# Altium schematic sheet Controller-Old.SchDoc
size A3
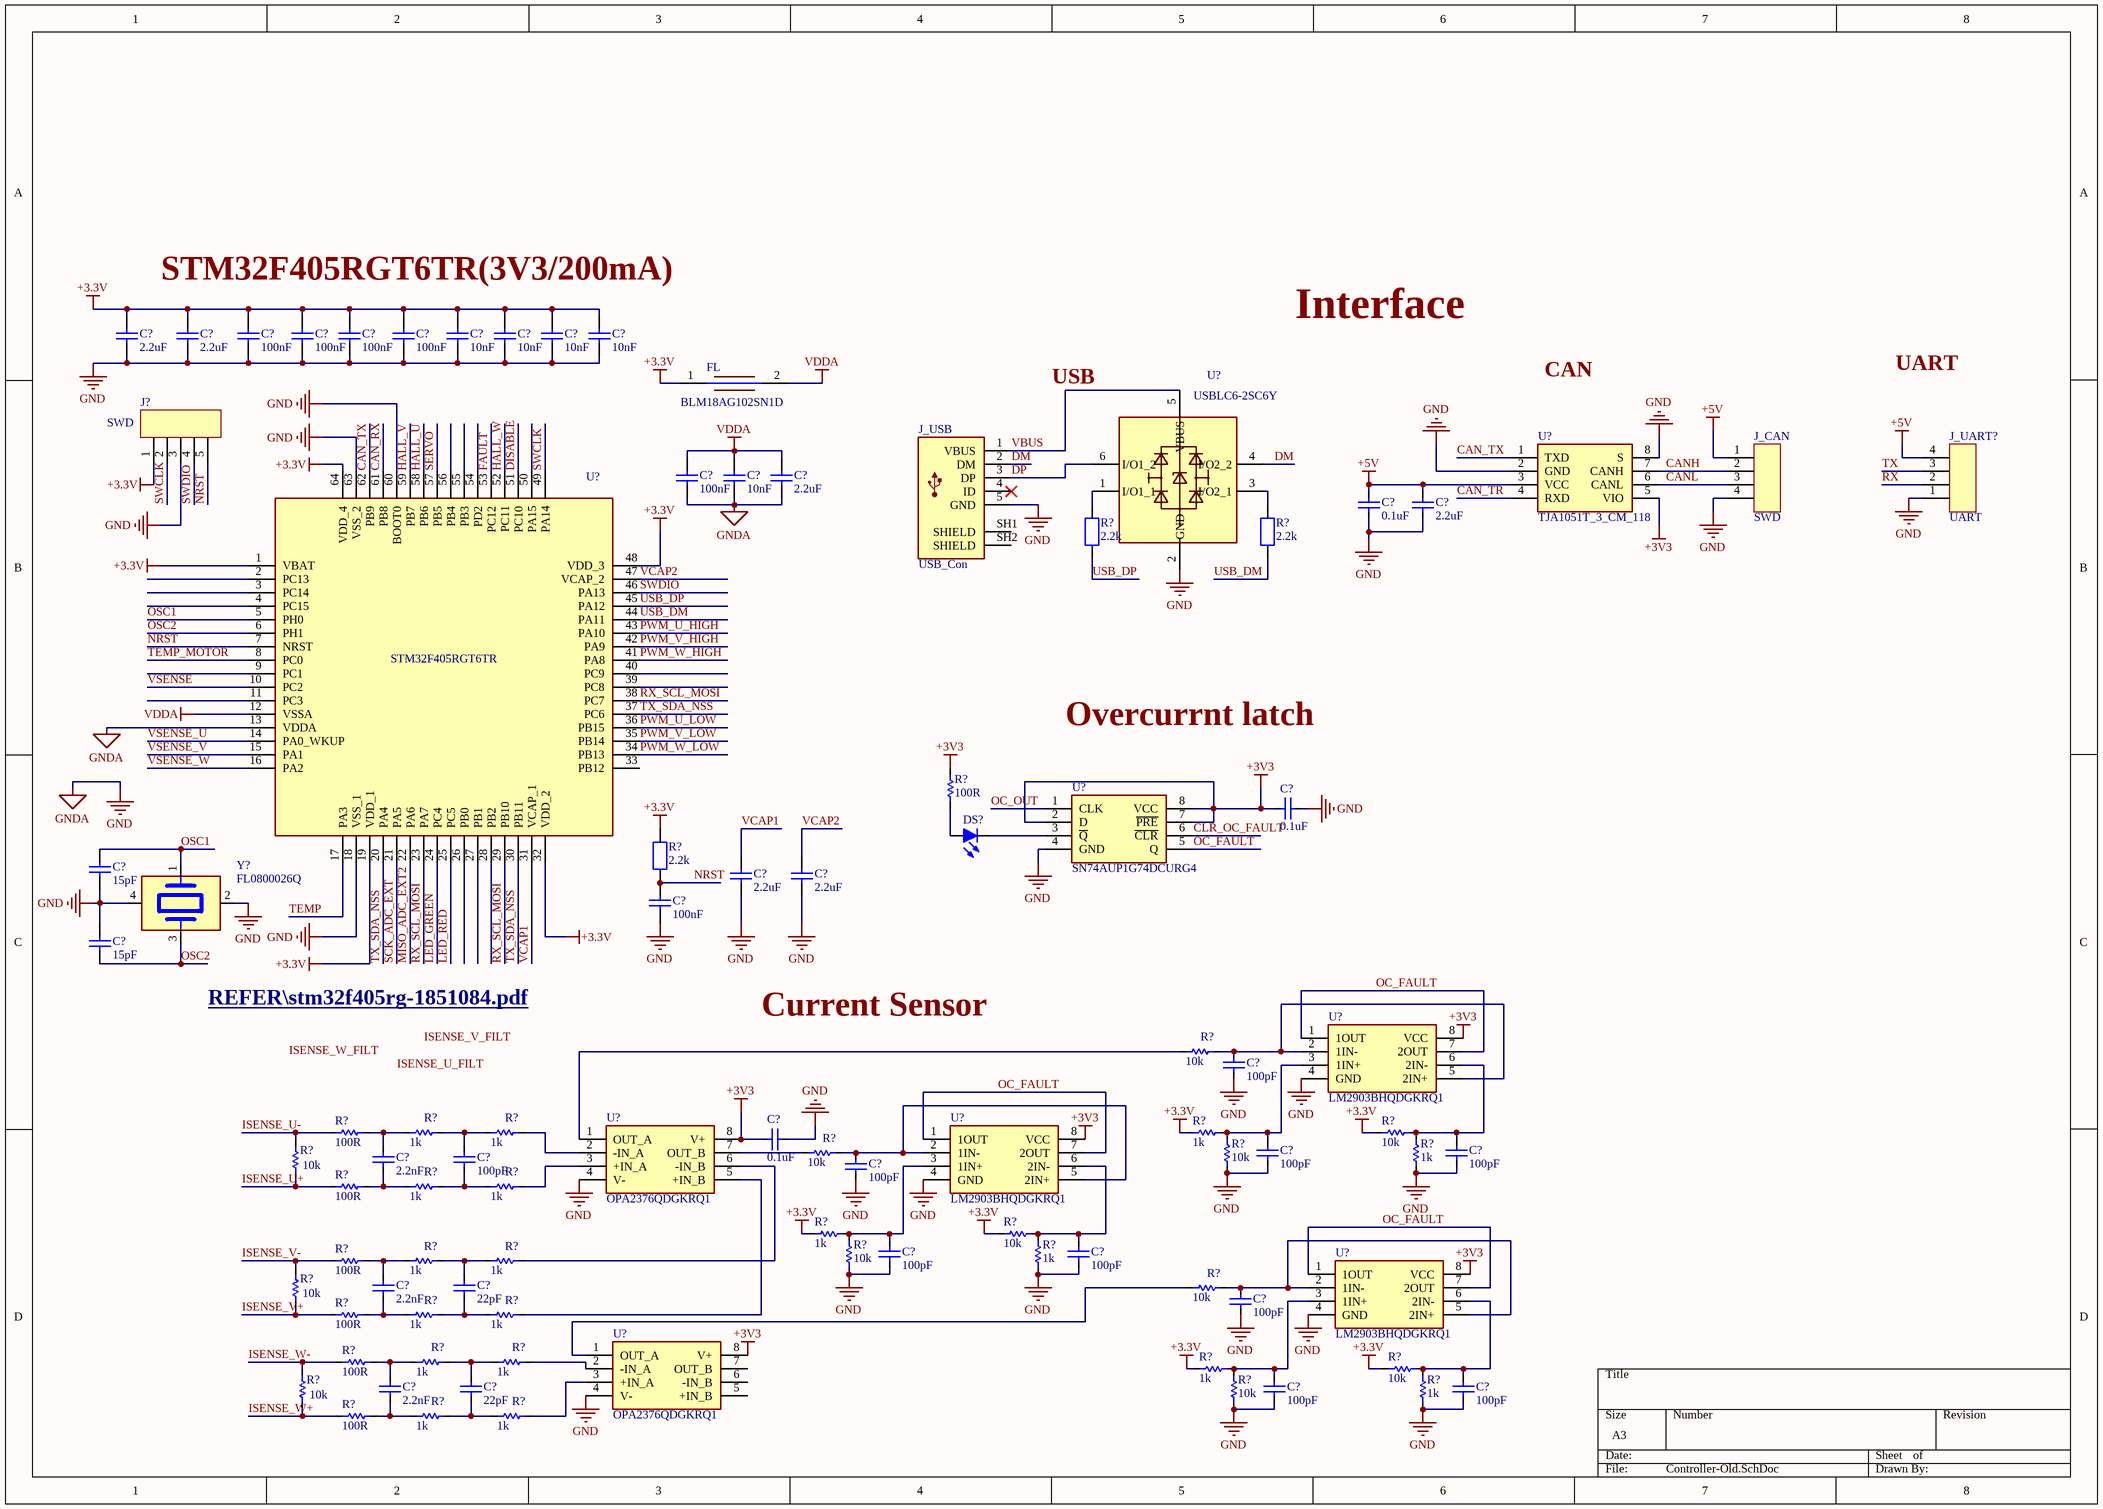
[diagram p0: Controller-Old.SchDoc]

## Parts
(Parts that share a designator on the sheet are numbered #1, #2 ... from top to bottom, then left to right.)
C?#1  2.2uF  [C0603]
C?#2  2.2uF  [C0603]
C?#3  100nF  [C0402]
C?#4  100nF  [C0402]
C?#5  100nF  [C0402]
C?#6  100nF  [C0402]
C?#7  10nF  [C0402]
C?#8  10nF  [C0402]
C?#9  10nF  [C0402]
C?#10  10nF  [C0402]
C?#11  100nF  [C0402]
C?#12  10nF  [C0402]
C?#13  2.2uF  [C0603]
C?#14  0.1uF  [SMD_C(0402)]
C?#15  2.2uF  [SMD_C(0603)]
C?#16  0.1uF  [SMD_C(0402)]
C?#17  15pF  [C0402]
C?#18  2.2uF  [C0603]
C?#19  2.2uF  [C0603]
C?#20  100nF  [C0402]
C?#21  15pF  [C0402]
C?#22  100pF  [SMD_C(0402)]
C?#23  0.1uF  [SMD_C(0402)]
C?#24  100pF  [SMD_C(0402)]
C?#25  100pF  [SMD_C(0402)]
C?#26  2.2nF  [SMD_C(0402)]
C?#27  100pF  [SMD_C(0402)]
C?#28  100pF  [SMD_C(0402)]
C?#29  100pF  [SMD_C(0402)]
C?#30  100pF  [SMD_C(0402)]
C?#31  2.2nF  [SMD_C(0402)]
C?#32  22pF  [SMD_C(0402)]
C?#33  100pF  [SMD_C(0402)]
C?#34  2.2nF  [SMD_C(0402)]
C?#35  22pF  [SMD_C(0402)]
C?#36  100pF  [SMD_C(0402)]
C?#37  100pF  [SMD_C(0402)]
DS?  SML-D12U1WT86  [LED0603]  (value not drawn)
FL  BLM18AG102SN1D  [BLM18EG121SH1D]
J?  SWD  [Header-2.54m-5pin]
J_CAN  SWD  [Header-2.54m-4pin]
J_UART?  UART  [Header-2.54m-4pin]
J_USB  USB_Con  [10118194-0001LF]
R?#1  2.2k  [R0603]
R?#2  2.2k  [R0603]
R?#3  100R  [SMD_R(0402)]
R?#4  2.2k  [R0603]
R?#5  10k  [SMD_R(0402)]
R?#6  1k  [SMD_R(0402)]
R?#7  10k  [SMD_R(0402)]
R?#8  10k  [SMD_R(0402)]
R?#9  1k  [SMD_R(0402)]
R?#10  10k  [SMD_R(0402)]
R?#11  100R  [SMD_R(0402)]
R?#12  1k  [SMD_R(0402)]
R?#13  1k  [SMD_R(0402)]
R?#14  10k  [SMD_R(0402)]
R?#15  100R  [SMD_R(0402)]
R?#16  1k  [SMD_R(0402)]
R?#17  1k  [SMD_R(0402)]
R?#18  1k  [SMD_R(0402)]
R?#19  10k  [SMD_R(0402)]
R?#20  10k  [SMD_R(0402)]
R?#21  1k  [SMD_R(0402)]
R?#22  10k  [SMD_R(0402)]
R?#23  100R  [SMD_R(0402)]
R?#24  1k  [SMD_R(0402)]
R?#25  1k  [SMD_R(0402)]
R?#26  10k  [SMD_R(0402)]
R?#27  100R  [SMD_R(0402)]
R?#28  1k  [SMD_R(0402)]
R?#29  1k  [SMD_R(0402)]
R?#30  1k  [SMD_R(0402)]
R?#31  10k  [SMD_R(0402)]
R?#32  10k  [SMD_R(0402)]
R?#33  100R  [SMD_R(0402)]
R?#34  1k  [SMD_R(0402)]
R?#35  1k  [SMD_R(0402)]
R?#36  10k  [SMD_R(0402)]
R?#37  1k  [SMD_R(0402)]
R?#38  100R  [SMD_R(0402)]
R?#39  1k  [SMD_R(0402)]
R?#40  1k  [SMD_R(0402)]
U?#1  TJA1051T_3_CM_118  [SOIC127P600X175-8N]
U?#2  USBLC6-2SC6Y  [SOT95P280X145-6N]
U?#3  STM32F405RGT6TR  [QFP50P1200X1200X160-64N]
U?#4  SN74AUP1G74DCURG4  [SOP50P310X90-8N]
U?#5  LM2903BHQDGKRQ1  [SOP65P490X110-8N]
U?#6  OPA2376QDGKRQ1  [SOP65P490X110-8N]
U?#7  LM2903BHQDGKRQ1  [SOP65P490X110-8N]
U?#8  LM2903BHQDGKRQ1  [SOP65P490X110-8N]
U?#9  OPA2376QDGKRQ1  [SOP65P490X110-8N]
Y?  FL0800026Q  [XTAL_FL0800026Q]

## Nets
+3.3V: C?#1.2 C?#2.2 C?#3.2 C?#4.2 C?#5.2 C?#6.2 C?#7.2 C?#8.2 C?#9.2 C?#10.2 FL.1 J?.1 R?#4.2 R?#6.1 R?#7.1 R?#18.1 R?#19.1 R?#30.1 R?#31.1 U?#3.1(VBAT) U?#3.19(VDD_1) U?#3.32(VDD_2) U?#3.48(VDD_3) U?#3.64(VDD_4)
+3V3: C?#16.2 C?#23.1 R?#3.2 U?#1.5(VIO) U?#4.2(D) U?#4.7(~{PRE}) U?#4.8(VCC) U?#5.8(VCC) U?#6.8(V+) U?#7.8(VCC) U?#8.8(VCC) U?#9.8(V+)
+5V: C?#14.2 C?#15.2 J_CAN.1 J_UART?.4 U?#1.3(VCC)
GND: C?#1.1 C?#2.1 C?#3.1 C?#4.1 C?#5.1 C?#6.1 C?#7.1 C?#8.1 C?#9.1 C?#10.1 C?#11.1 C?#12.1 C?#13.1 C?#14.1 C?#15.1 C?#16.1 C?#17.1 C?#18.1 C?#19.1 C?#20.1 C?#21.2 C?#22.1 C?#23.2 C?#24.1 C?#25.1 C?#28.1 C?#29.1 C?#30.1 C?#33.1 C?#36.1 C?#37.1 J?.3 J_CAN.4 J_UART?.1 J_USB.5(GND) R?#8.2 R?#9.2 R?#20.2 R?#21.2 R?#36.2 R?#37.2 U?#1.2(GND) U?#1.8(S) U?#2.2(GND) U?#3.13(VDDA) U?#3.18(VSS_1) U?#3.60(BOOT0) U?#3.63(VSS_2) U?#4.4(GND) U?#5.4(GND) U?#6.4(V-) U?#7.4(GND) U?#8.4(GND) U?#9.4(V-) Y?.2(GND) Y?.4(GND)  [also labelled GNDA]
VDDA: C?#11.2 C?#12.2 C?#13.2 FL.2 U?#3.12(VSSA)
CAN_RX: U?#3.61(PB8)
CAN_TR: U?#1.4(RXD)
CAN_TX: U?#1.1(TXD) U?#3.62(PB9)
CANH: J_CAN.2 U?#1.7(CANH)
CANL: J_CAN.3 U?#1.6(CANL)
CLR_OC_FAULT: U?#4.6(~{CLR})
DISABLE: U?#3.51(PC10)
DM: J_USB.2(DM) U?#2.4(I/O2_2)
DP: J_USB.3(DP) U?#2.6(I/O1_2)
FAULT: U?#3.53(PC12)
HALL_U: U?#3.58(PB6)
HALL_V: U?#3.59(PB7)
HALL_W: U?#3.52(PC11)
ISENSE_U+: R?#10.2 R?#15.2
ISENSE_U-: R?#10.1 R?#11.2
ISENSE_V+: R?#22.2 R?#27.2
ISENSE_V-: R?#22.1 R?#23.2
ISENSE_W+: R?#32.2 R?#38.2
ISENSE_W-: R?#32.1 R?#33.2
LED_GREEN: U?#3.24(PC4)
LED_RED: U?#3.25(PC5)
MISO_ADC_EXT2: U?#3.22(PA6)
NRST: C?#20.2 J?.5 R?#4.1 U?#3.7(NRST)
OC_FAULT: U?#4.5(Q) U?#5.1(1OUT) U?#5.7(2OUT) U?#7.1(1OUT) U?#7.7(2OUT) U?#8.1(1OUT) U?#8.7(2OUT)
OC_OUT: U?#4.1(CLK)
OSC1: C?#17.2 U?#3.5(PH0) Y?.1
OSC2: C?#21.1 U?#3.6(PH1) Y?.3
PWM_U_HIGH: U?#3.43(PA10)
PWM_U_LOW: U?#3.36(PB15)
PWM_V_HIGH: U?#3.42(PA9)
PWM_V_LOW: U?#3.35(PB14)
PWM_W_HIGH: U?#3.41(PA8)
PWM_W_LOW: U?#3.34(PB13)
RX: J_UART?.2
RX_SCL_MOSI: U?#3.23(PA7) U?#3.29(PB10) U?#3.38(PC7)
SCK_ADC_EXT: U?#3.21(PA5)
SERVO: U?#3.57(PB5)
SWCLK: J?.2 U?#3.49(PA14)
SWDIO: J?.4 U?#3.46(PA13)
TEMP: U?#3.17(PA3)
TEMP_MOTOR: U?#3.8(PC0)
TX: J_UART?.3
TX_SDA_NSS: U?#3.20(PA4) U?#3.30(PB11) U?#3.37(PC6)
USB_DM: R?#2.1 U?#3.44(PA11)
USB_DP: R?#1.1 U?#3.45(PA12)
VBUS: J_USB.1(VBUS) U?#2.5(VBUS)
VCAP1: C?#18.2 U?#3.31(VCAP_1)
VCAP2: C?#19.2 U?#3.47(VCAP_2)
VSENSE: U?#3.10(PC2)
VSENSE_U: U?#3.14(PA0_WKUP)
VSENSE_V: U?#3.15(PA1)
VSENSE_W: U?#3.16(PA2)
NetC?#22_2: C?#22.2 R?#5.1 U?#5.2(1IN-) U?#5.5(2IN+)
NetC?#24_2: C?#24.2 R?#6.2 R?#8.1 U?#5.3(1IN+)
NetC?#25_2: C?#25.2 R?#7.2 R?#9.1 U?#5.6(2IN-)
NetC?#26_1: C?#26.1 R?#15.1 R?#16.2
NetC?#26_2: C?#26.2 R?#11.1 R?#12.2
NetC?#27_1: C?#27.1 R?#16.1 R?#17.2
NetC?#27_2: C?#27.2 R?#12.1 R?#13.2
NetC?#28_2: C?#28.2 R?#14.1 U?#7.2(1IN-) U?#7.5(2IN+)
NetC?#29_2: C?#29.2 R?#18.2 R?#20.1 U?#7.3(1IN+)
NetC?#30_2: C?#30.2 R?#19.2 R?#21.1 U?#7.6(2IN-)
NetC?#31_1: C?#31.1 R?#27.1 R?#28.2
NetC?#31_2: C?#31.2 R?#23.1 R?#24.2
NetC?#32_1: C?#32.1 R?#28.1 R?#29.2
NetC?#32_2: C?#32.2 R?#24.1 R?#25.2
NetC?#33_2: C?#33.2 R?#26.1 U?#8.2(1IN-) U?#8.5(2IN+)
NetC?#34_1: C?#34.1 R?#38.1 R?#39.2
NetC?#34_2: C?#34.2 R?#33.1 R?#34.2
NetC?#35_1: C?#35.1 R?#39.1 R?#40.2
NetC?#35_2: C?#35.2 R?#34.1 R?#35.2
NetC?#36_2: C?#36.2 R?#30.2 R?#36.1 U?#8.3(1IN+)
NetC?#37_2: C?#37.2 R?#31.2 R?#37.1 U?#8.6(2IN-)
NetDS?_A: DS?.A R?#3.1
NetDS?_C: DS?.C U?#4.3(~{Q})
NetR?#1_2: R?#1.2 U?#2.1(I/O1_1)
NetR?#2_2: R?#2.2 U?#2.3(I/O2_1)
NetR?#5_2: R?#5.2 U?#6.1(OUT_A)
NetR?#13_1: R?#13.1 U?#6.2(-IN_A)
NetR?#14_2: R?#14.2 U?#6.7(OUT_B)
NetR?#17_1: R?#17.1 U?#6.3(+IN_A)
NetR?#25_1: R?#25.1 U?#6.6(-IN_B)
NetR?#26_2: R?#26.2 U?#9.1(OUT_A)
NetR?#29_1: R?#29.1 U?#6.5(+IN_B)
NetR?#35_1: R?#35.1 U?#9.2(-IN_A)
NetR?#40_1: R?#40.1 U?#9.3(+IN_A)

Not connected (* = marked no-connect by the designer): J_USB 4(ID)* SH1(SHIELD) SH2(SHIELD); U?#3 2(PC13) 3(PC14) 4(PC15) 9(PC1) 11(PC3) 26(PB0) 27(PB1) 28(PB2) 33(PB12) 39(PC8) 40(PC9) 50(PA15) 54(PD2) 55(PB3) 56(PB4); U?#9 5(+IN_B) 6(-IN_B) 7(OUT_B)

## Notes on the sheet
- (near C?#2) STM32F405RGT6TR(3V3/200mA)
- Interface
- CAN
- UART
- (near U?#2) USB
- Overcurrnt latch
- REFER\stm32f405rg-1851084.pdf <F:\TASK\2023\8\VESC_MotorController\REFER\STM32f405rg-1851084.pdf>
- Current Sensor
- Labels drawn without touching a wire or pin: ISENSE_U_FILT, ISENSE_V_FILT, ISENSE_W_FILT

## Library data of the parts
C?#1 C?#2 C?#13 C?#18 C?#19 = 2.2uF ± 10% 50V: Manufacturer: Yageo; Manufacturer Part Number: GRM188R61H225ME11J; Value: 2.2uF; Supplier: mouser; Supplier Part Number: 81-GRM188R61H225ME1J; Price: 0.3
C?#3-C?#6 C?#11 C?#20 = 100nF ± 10% 50V: Manufacturer: Yageo; Manufacturer Part Number: CS0603KRX7R9BB104; Value: 100nF; Supplier: mouser; Supplier Part Number: 603-CS0603KRX79BB104; Price: 0.1
C?#7-C?#10 C?#12 = 10nF ± 10% 50V: Manufacturer: Yageo; Manufacturer Part Number: CS0603KRX79BB103; Value: 10nF; Supplier: mouser; Supplier Part Number: 603-CS0603KRX79BB103; Price: 0.1
C?#14 C?#16 C?#23 = Cap_1: Multilayer Ceramic Capacitors MLCC - SMD/SMT 50 V 0.1uF X7R 0603 10%; Manufacturer: Yageo; Manufacturer Part Number: CC0603KPX7R9BB104; Supplier 1: Digi-Key; Supplier Part Number 1: 311-3567-1-ND
C?#15 = Cap_4: Multilayer Ceramic Capacitors MLCC - SMD/SMT 2.2 uF 50 VDC 10% 1206 X7R AEC-Q200; Manufacturer: Yageo; Manufacturer Part Number: GCM31CR71H225KA55K; Supplier 1: Digi-Key; Supplier Part Number 1: 311-3567-1-ND
C?#17 C?#21 = 15pF ± 10% 50V: Manufacturer: Yageo; Manufacturer Part Number: CS0603KRX79BB150; Value: 15pF; Supplier: mouser; Supplier Part Number: 603-CS0603KRX79BB150; Price: 0.1
C?#22 C?#24-C?#37 = Cap_7: PHE840MA6100MA04R17; Manufacturer: Yageo; Manufacturer Part Number: CC0603KPX7R9BB104; Supplier 1: Digi-Key; Supplier Part Number 1: 311-3567-1-ND
DS? = SML-D12U1WT86: Typical RED GaAs LED; Manufacturer: Rohm Semiconductor; Supplier: Mouser; Supplier Part Number: 755-SML-D12U1WT86; Manufacturer Part Number: SML-D12U1WT86; Value: SML-D12U1WT86; Price: 0.2
FL = BLM18AG102SN1D: Ferrite Beads 1000 OHM 25% Alternate Sizing Guide Below; Manufacturer: Murata; Manufacturer Part Number: BLM18AG102SN1D; Price: 0.15; Supplier Part Number: 81-BLM11A102S; Value: BLM18AG102SN1D; Supplier: Mouser
J? = 5PinConnector
J_CAN J_UART? = 4PinConnector
J_USB = USB_Con: USB - micro B USB 2.0 Receptacle Connector 5 Position Through Hole; Manufacturer Part Number: 614105150721; Manufacturer: Wurth Electronics; Value: 614105150721; Price: 3; Supplier Part Number: 710-614105150721; Supplier: Mouser
R?#1 R?#2 R?#4 = 2.2 kOhms ±1% 0.1W: Manufacturer: Yageo; Manufacturer Part Number: RC0603FR-072K2L; Value: 2.2k; Supplier: Mouser; Supplier Part Number: 603-RC0603FR-072K2L; Price: 0.1
R?#3 R?#5-R?#40 = Res Semi_1: CRCW04024R02FKED; Published: 8-Jun-2000; LatestRevisionDate: 17-Jul-2002; LatestRevisionNote: Re-released for DXP Platform.; PackageReference: AXIAL-0.5; Publisher: Altium Limited; PackageDescription: Axial Device, Thru-Hole; 2 Leads; 0.5 in Pin Spacing
U?#1 = TJA1051T_3_CM_118: CAN Interface IC BL Advanced Automotive Analog; Manufacturer: NXP Semiconductors; Manufacturer Part Number: TJA1051T/3/CM,118; Value: TJA1051T/3/CM,118; Supplier Part Number: 771-TJA1051T/3CM118; Supplier: Mouser; Price: 2.33
U?#2 = USBLC6-2SC6Y: Low Cap. ESD Protection Auto SOT-23-6 STMicroelectronics USBLC6-2SC6Y, Dual Uni-Directional TVS Diode Array, 6-Pin SOT-23; Supplier Part Number: 511-USBLC6-2SC6Y; Supplier: Mouser; Manufacturer Part Number: USBLC6-2SC6Y; Price: 1.45; Manufacturer: STMicroelectronics; Value: USBLC6-2SC6Y
U?#3 = STM32F405RGT6TR: STM32F405RGT6TR, 32 bit ARM Cortex M4 MCU 168MHz 1024 kB Flash, 192 kB RAM, 2xUSB CAN I2C 64-Pin LQFP; Manufacturer_Name: STMicroelectronics; Geometry.Height: 1.6mm; Mouser Part Number: 511-STM32F405RGT6TR; Mouser Price/Stock: https://www.mouser.co.uk/ProductDetail/STMicroelectronics/STM32F405RGT6TR?qs=MavH1QghrkHshpR6GkvPIg%3D%3D; Manufacturer_Part_Number: STM32F405RGT6TR; Datasheet Link: http://www.st.com/web/en/resource/technical/document/datasheet/DM00037051.pdf
U?#4 = SN74AUP1G74DCURG4: Flip Flops Lo PWR SNGL Pos Edge Trgrd DType FlipFlop; Manufacturer_Name: Texas Instruments; Geometry.Height: 0.9mm; Mouser Part Number: 595-74AUP1G74DCURG4; Mouser Price/Stock: https://www.mouser.co.uk/ProductDetail/Texas-Instruments/SN74AUP1G74DCURG4?qs=7kv20MEVUlhYDCdFtbMd%2FA%3D%3D; Manufacturer_Part_Number: SN74AUP1G74DCURG4; Datasheet Link: *
U?#5 U?#7 U?#8 = LM2903BHQDGKRQ1: Analog Comparators Automotive, dual, differential, commodity comparator; Manufacturer_Name: Texas Instruments; Geometry.Height: 1.1mm; Mouser Part Number: 595-LM2903BHQDGKRQ1; Mouser Price/Stock: https://www.mouser.co.uk/ProductDetail/Texas-Instruments/LM2903BHQDGKRQ1?qs=By6Nw2ByBD2mW87GUmotXw%3D%3D; Manufacturer_Part_Number: LM2903BHQDGKRQ1; Datasheet Link: https://www.ti.com/lit/ds/symlink/lm2903b-q1.pdf?HQS=dis-mous-null-mousermode-dsf-pf-null-wwe&ts=1670767488652&ref_url=https%253A%252F%252Fwww.mouser.de%252F
U?#6 U?#9 = OPA2376QDGKRQ1: Low Noise, Low Quiescent Current, Precision Operational Amplifier e-trim/trade; Manufacturer_Name: Texas Instruments; Geometry.Height: 1.1mm; Mouser Part Number: 595-OPA2376QDGKRQ1; Mouser Price/Stock: https://www.mouser.co.uk/ProductDetail/Texas-Instruments/OPA2376QDGKRQ1?qs=zEmsApcVOkU338m46%2F1O7A%3D%3D; Manufacturer_Part_Number: OPA2376QDGKRQ1; Datasheet Link: http://www.ti.com/lit/gpn/opa2376-q1
Y? = FL0800026Q: 8 MHz A±30ppm Crystals Crystal Ceramic SEAM3225 T&R 3K; Manufacturer: Diodes Incorporated; Value: 8MHz; Price: 0.5; Supplier: Mouser; Manufacturer Part Number: FL0800026Q; Supplier Part Number: 621-FL0800026Q